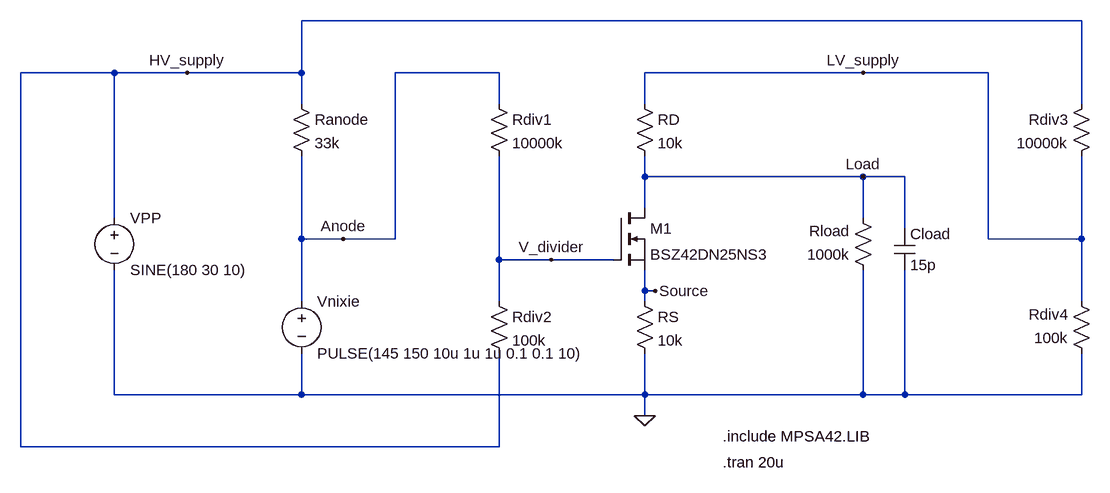
[diagram p0: schematic common_emitter.asc]
common_emitter.asc, the LTspice schematic file:
Version 4
SHEET 1 1056 680
WIRE 944 -192 -256 -192
WIRE -544 -112 -688 -112
WIRE -432 -112 -544 -112
WIRE -256 -112 -256 -192
WIRE -256 -112 -432 -112
WIRE 48 -112 -112 -112
WIRE 608 -112 272 -112
WIRE 800 -112 608 -112
WIRE -256 -64 -256 -112
WIRE 48 -64 48 -112
WIRE 272 -64 272 -112
WIRE 944 -64 944 -192
WIRE 272 48 272 16
WIRE 608 48 272 48
WIRE 672 48 608 48
WIRE 272 96 272 48
WIRE -544 112 -544 -112
WIRE 608 112 608 48
WIRE 672 128 672 48
WIRE -256 144 -256 16
WIRE -192 144 -256 144
WIRE -112 144 -112 -112
WIRE -112 144 -192 144
WIRE 800 144 800 -112
WIRE 944 144 944 16
WIRE 944 144 800 144
WIRE 48 176 48 16
WIRE 128 176 48 176
WIRE 224 176 128 176
WIRE 272 224 272 192
WIRE 288 224 272 224
WIRE -256 240 -256 144
WIRE 48 240 48 176
WIRE 272 240 272 224
WIRE 944 240 944 144
WIRE -544 384 -544 192
WIRE -256 384 -256 320
WIRE -256 384 -544 384
WIRE 272 384 272 320
WIRE 272 384 -256 384
WIRE 608 384 608 192
WIRE 608 384 272 384
WIRE 672 384 672 192
WIRE 672 384 608 384
WIRE 944 384 944 320
WIRE 944 384 672 384
WIRE 272 416 272 384
WIRE -688 464 -688 -112
WIRE 48 464 48 320
WIRE 48 464 -688 464
FLAG 272 416 0
FLAG 608 48 Load
FLAG -192 144 Anode
FLAG -432 -112 HV_supply
FLAG 128 176 V_divider
FLAG 608 -112 LV_supply
FLAG 288 224 Source
SYMBOL res 256 224 R0
SYMATTR InstName RS
SYMATTR Value 10k
SYMBOL res 32 -80 R0
SYMATTR InstName Rdiv1
SYMATTR Value 10000k
SYMBOL res 256 -80 R0
SYMATTR InstName RD
SYMATTR Value 10k
SYMBOL voltage -544 96 R0
WINDOW 123 0 0 Left 0
WINDOW 39 0 0 Left 0
SYMATTR InstName VPP
SYMATTR Value SINE(180 30 10)
SYMBOL voltage -256 224 R0
WINDOW 123 0 0 Left 0
WINDOW 39 0 0 Left 0
SYMATTR InstName Vnixie
SYMATTR Value PULSE(145 150 10u 1u 1u 0.1 0.1 10)
SYMBOL res -272 -80 R0
SYMATTR InstName Ranode
SYMATTR Value 33k
SYMBOL res 32 224 R0
SYMATTR InstName Rdiv2
SYMATTR Value 100k
SYMBOL res 624 208 R180
WINDOW 0 36 76 Left 2
WINDOW 3 36 40 Left 2
SYMATTR InstName Rload
SYMATTR Value 1000k
SYMBOL cap 656 128 R0
SYMATTR InstName Cload
SYMATTR Value 15p
SYMBOL res 960 -80 M0
SYMATTR InstName Rdiv3
SYMATTR Value 10000k
SYMBOL res 960 336 R180
WINDOW 0 36 76 Left 2
WINDOW 3 36 40 Left 2
SYMATTR InstName Rdiv4
SYMATTR Value 100k
SYMBOL nmos 224 96 R0
SYMATTR InstName M1
SYMATTR Value BSZ42DN25NS3
TEXT 392 488 Left 2 !.tran 20u
TEXT 392 448 Left 2 !.include MPSA42.LIB

The netlist it stands for:
* common_emitter.asc
RS Source 0 10k
Rdiv1 Anode V_divider 10000k
RD LV_supply Load 10k
VPP HV_supply 0 SINE(180 30 10)
Vnixie Anode 0 PULSE(145 150 10u 1u 1u 0.1 0.1 10)
Ranode HV_supply Anode 33k
Rdiv2 V_divider HV_supply 100k
Rload 0 Load 1000k
Cload Load 0 15p
Rdiv3 HV_supply LV_supply 10000k
Rdiv4 0 LV_supply 100k
M1 Load V_divider Source Source BSZ42DN25NS3
.model NMOS NMOS
.model PMOS PMOS
.lib standard.mos
.tran 20u
.include MPSA42.LIB
.backanno
.end